# EAGLE design sleep_light (EAGLE 7.5.0)
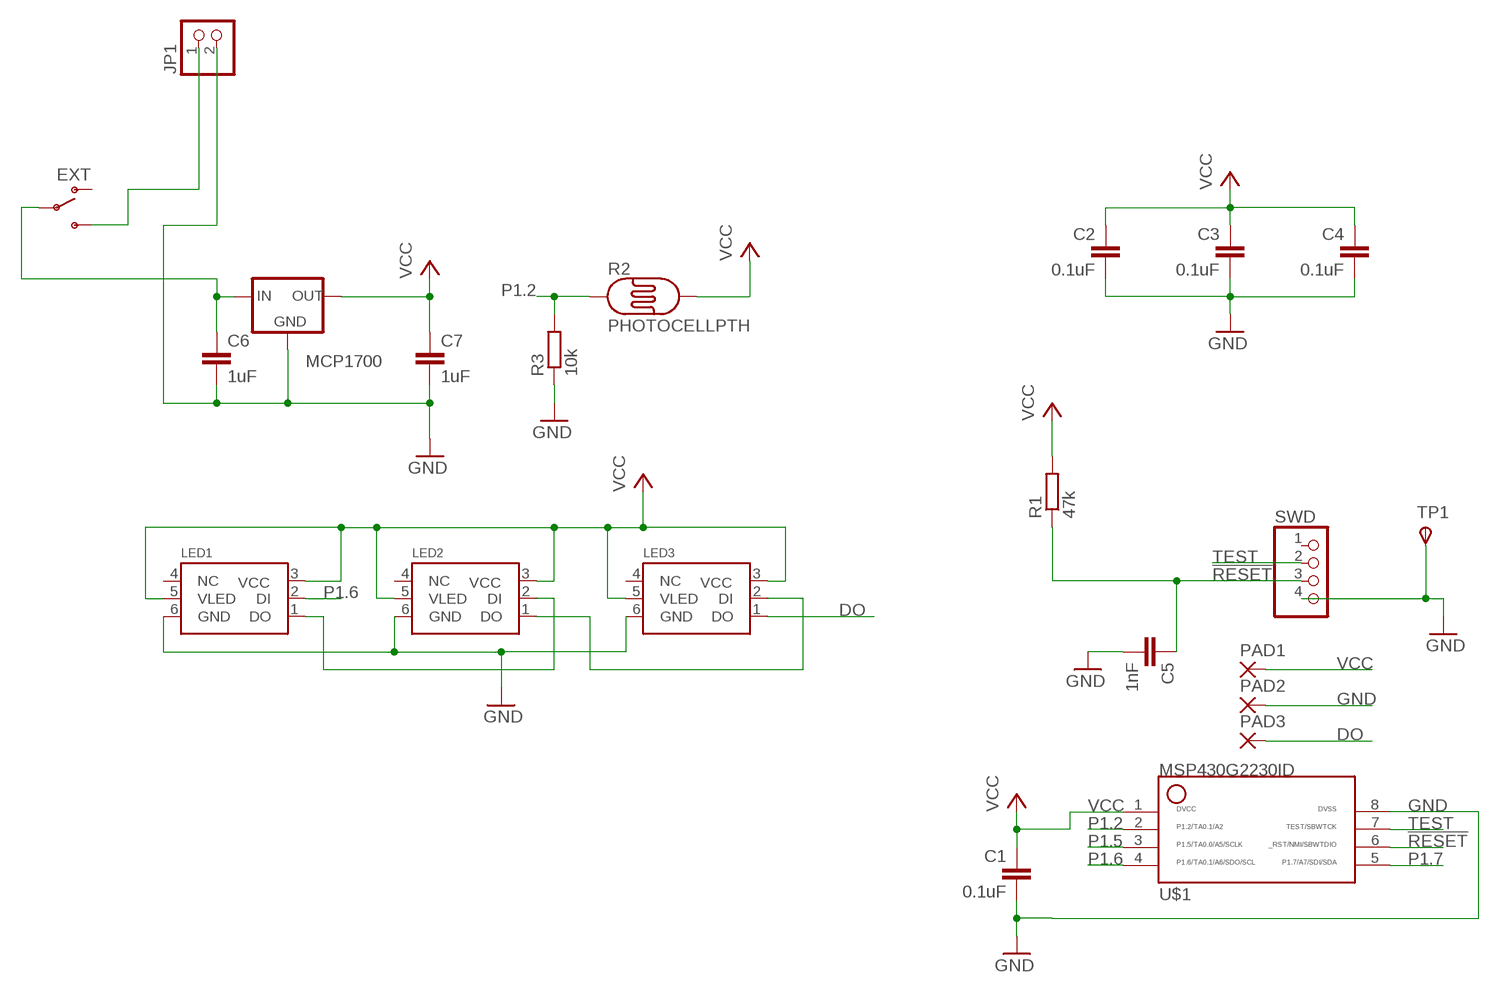
[diagram p0: schematic, sheet 1]

## Parts
C1  0.1uF  C-EUC0805  [C0805]
C2  0.1uF  C-EUC0805  [C0805]
C3  0.1uF  C-EUC0805  [C0805]
C4  0.1uF  C-EUC0805  [C0805]
C5  1nF  C-EUC0805  [C0805]
C6  1uF  C-EUC0805  [C0805]
C7  1uF  C-EUC0805  [C0805]
JP1  PINHD-1X2  [1X02]
LED1  5050WS2811W  [RGBLED5050W]
LED2  5050WS2811W  [RGBLED5050W]
LED3  5050WS2811W  [RGBLED5050W]
MCP1700  MCP1700  MCP1700SOT-23  [SOT-23]
ON  EXT  SWITCH-SPSTPTH  [SWITCH-SPDT]
PAD1  SMD2  [SMD1,27-2,54]
PAD2  SMD2  [SMD1,27-2,54]
PAD3  SMD2  [SMD1,27-2,54]
R1  47k  R-EU_R0805  [R0805]
R2  PHOTOCELLPTH  [PHOTOCELL]
R3  10k  R-EU_R0805  [R0805]
SWD  PINHD-1X4  [1X04]
TP1  TPSTP20R  [TP20R]
U$1  MSP430G2230ID  [SO08]

## Nets
!RESET: C5.1 R1.1 SWD.3 U$1.6
DO: LED3.1(DO) PAD3.1(P)
GND [GND]: C1.2 C2.2 C3.2 C4.2 C5.2 C6.2 C7.2 JP1.2 LED1.6(GND) LED2.6(GND) LED3.6(GND) MCP1700.1(GND) PAD2.1(P) R3.1 SWD.4 TP1.TP(PP) U$1.8
N$3 [VCC]: JP1.1 ON.3(S)
N$6: LED2.1(DO) LED3.2(DI)
N$7: LED1.1(DO) LED2.2(DI)
N$15 [VCC]: C6.1 MCP1700.3(IN) ON.2(P)
P1.2: R2.1 R3.2 U$1.2
P1.5: U$1.3
P1.6: LED1.2(DI) U$1.4
P1.7: U$1.5
TEST: SWD.2 U$1.7
VCC [VCC]: C1.1 C2.1 C3.1 C4.1 C7.1 LED1.3(VCC) LED1.5(VLED) LED2.3(VCC) LED2.5(VLED) LED3.3(VCC) LED3.5(VLED) MCP1700.2(OUT) PAD1.1(P) R1.2 R2.2 U$1.1
Unconnected: LED1.4(NC) LED2.4(NC) LED3.4(NC) ON.1(O) SWD.1

## Library data of the parts
C1-C7 = resistor:C-EU: CAPACITOR, European symbol
JP1 = pinhead:PINHD-1X2: PIN HEADER
LED1-LED3 = 5050WS2811:5050WS2811
MCP1700 = MY_IC:MCP1700
ON = SparkFun:SWITCH-SPST: SPST Switch Simple slide switch. Spark Fun Electronics SKU : COM-00102
PAD1-PAD3 = wirepad:SMD2: SMD PAD
R1 R3 = resistor:R-EU_: RESISTOR, European symbol
R2 = SparkFun:PHOTOCELL: Photocell Also known as a CdS photoresistor. This is a low cost way to detect light levels. Resistance decreases with more incoming light. SparkFun SKU: SEN-09088
SWD = pinhead:PINHD-1X4: PIN HEADER
TP1 = testpad:TPS: TEST PIN
U$1 = thierry_eagle:MSP430G2230ID

## Net classes
0 default: width 0.406 mm, drill 0.508 mm
1 GND: width 0.61 mm, drill 0.508 mm
2 VCC: width 1.016 mm, drill 0.508 mm

## Board
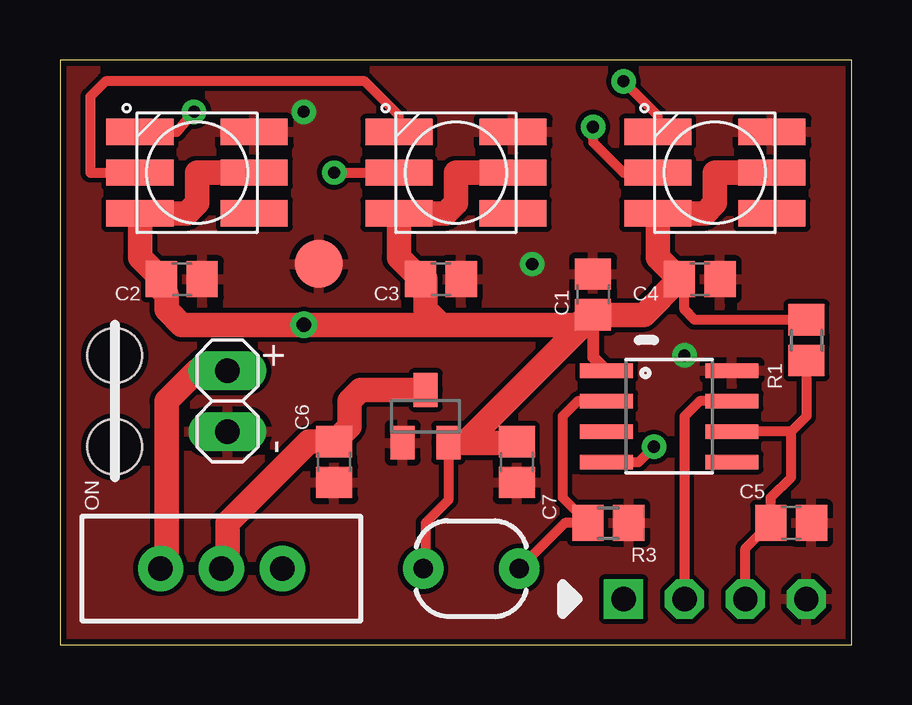
[diagram p1: board, top side]
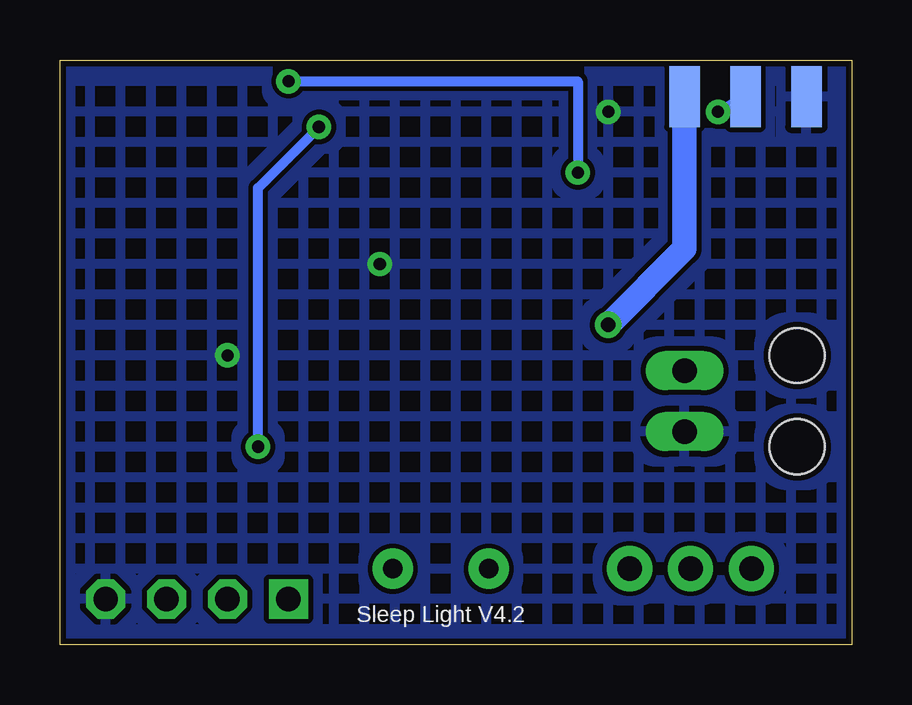
[diagram p2: board, bottom side, seen from below]

Size 33.02 x 24.38 mm. Coordinates in mm from the lower left corner, seen from the top.
Outline: 0,0 33.02,0 33.02,24.38 0,24.38 0,0
Copper layers (1*16): Top 0.035mm / dielectric 1.5mm / Bottom 0.035mm
Design rules "SparkFun *": minimum track width 10mil, minimum drill 20mil, track to track 8mil, track to pad 8mil, pad to pad 8mil, via to via 8mil, smd to smd 8mil, copper to edge 10mil, drill to drill 8mil, minimum pad ring 12mil, minimum via ring 10mil, stop-mask expansion 4mil, vias tented up to drill 25mil, thermal gap 10mil
Holes 2.29 mm at 2.29,12.07 2.29,8.25

### Footprints (pad centres in the part's own frame; a part is rotated, then mirrored left to right if it is on the bottom)
C0805 = smd 1.3 x 1.5: 1 -0.85,0; 2 0.85,0
1X02 = drill 1.016 long: 1 -1.27,0; 2 1.27,0
RGBLED5050W = smd 2.794 x 1.1: 1 -2.381,1.7; 2 -2.381,0; 3 -2.381,-1.7; 4 2.381,-1.7; 5 2.381,0; 6 2.381,1.7
SOT-23 = smd 1 x 1.4: 1 -0.95,-1.1; 2 0.95,-1.1; 3 0,1.1
SWITCH-SPDT = drill 1.016 pad 1.88: 1 0,2.54; 2 0,0; 3 0,-2.54
SMD1,27-2,54 = smd 1.27 x 2.54: 1 0,0
R0805 = smd 1.3 x 1.5: 1 -0.85,0; 2 0.85,0
PHOTOCELL = drill 0.8 pad 1.676: 1 -2,0; 2 2,0
1X04 = drill 1.016 square: 1 -3.81,0 | drill 1.016 octagon: 2 -1.27,0; 3 1.27,0; 4 3.81,0
TP20R = smd 2 x 2: TP 0,0
SO08 = smd 0.61 x 2.21: 1 -1.905,-2.616; 2 -0.635,-2.616; 3 0.635,-2.616; 4 1.905,-2.616; 5 1.905,2.616; 6 0.635,2.616; 7 -0.635,2.616; 8 -1.905,2.616

### Placement (x,y rotation side)
C1  22.22,14.61 90 top
C2  5.08,15.24 0 top
C3  15.88,15.24 0 top
C4  26.67,15.24 0 top
C5  30.48,5.08 0 top
C6  11.43,7.62 270 top
C7  19.05,7.62 270 top
JP1  6.98,10.16 270 top
LED1  27.31,19.69 0 top
LED2  16.51,19.69 0 top
LED3  5.71,19.69 0 top
MCP1700  15.24,9.53 0 top
ON  6.73,3.17 270 top
PAD1  6.98,22.86 0 bottom
PAD2  1.91,22.86 0 bottom
PAD3  4.45,22.86 0 bottom
R1  31.11,12.7 90 top
R2  17.14,3.17 180 top
R3  22.86,5.08 180 top
SWD  27.31,1.91 0 top
TP1  10.8,15.88 0 top
U$1  25.4,9.53 270 top

### Tracks (layer width: path | path; a pad name or v marks a point on that pad's centre or on a via)
!RESET
  Top 0.406: SWD.3 28.57,4.02 C5.1 29.63,6.13 30.48,6.99 30.48,8.89 | R1.1 31.11,9.53 30.48,8.89 | 30.48,8.89 U$1.6
DO  (via drill 0.51)
  Top 0.406: LED3.1 4.88,21.39 v5.59,22.23
  Bottom 0.406: v5.59,22.23 PAD3.1
GND  (via drill 0.51)
  other vias: 10.16,22.23 19.68,15.88 26.04,12.07
  pour Bottom (hatched): -0.63,24.77 33.66,24.77 33.66,-0.64 -0.63,-0.64
  pour Top: -0.63,24.77 33.66,24.77 33.66,-0.64 -0.63,-0.64
N$3
  Top 1.016: JP1.1 5.71,11.43 4.45,10.16 4.45,3.43 ON.3
N$6
  Top 0.406: LED2.1 14.13,22.07 12.7,23.5 1.91,23.5 1.27,22.86 1.27,19.69 LED3.2
N$7  (via drill 0.51)
  Top 0.406: LED1.1 24.92,22.07 v23.5,23.5 | v11.43,19.69 LED2.2
  Bottom 0.406: v23.5,23.5 11.43,23.5 v11.43,19.69
N$15
  Top 1.016: ON.2 6.98,3.43 6.98,5.08 10.38,8.47 C6.1 12.07,9.11 12.07,10.16 12.53,10.62 MCP1700.3
P1.2
  Top 0.406: U$1.2 21.59,10.16 20.96,9.53 20.96,6.13 R3.2 21.05,5.08 R2.1
P1.6  (via drill 0.51)
  Top 0.406: U$1.4 24.13,7.62 v24.77,8.25 | v22.22,21.59 22.22,20.96 23.5,19.69 LED1.2
  Bottom 0.406: v24.77,8.25 24.77,19.05 v22.22,21.59
TEST
  Top 0.406: U$1.7 26.67,10.16 26.04,9.53 SWD.2
VCC  (via drill 0.6)
  Top 0.406: R1.2 26.46,13.55 26.04,13.97 26.04,15.03 C4.1 | MCP1700.2 16.19,6.03 15.24,5.08 15.24,3.27 R2.2
  Top 0.508: C1.1 22.22,11.99 U$1.1
  Top 1.016: LED3.5 5.71,19.69 5.71,18.41 5.29,17.98 LED3.3 3.33,16.14 C2.1 4.23,14.82 4.45,14.61 4.45,13.97 5.08,13.34 v10.16,13.34 15.88,13.34 | LED2.5 16.51,19.69 16.51,18.41 16.08,17.98 LED2.3 14.13,16.14 C3.1 15.24,15.24 15.24,13.97 15.88,13.34 | LED1.5 27.31,19.69 27.31,18.41 26.88,17.98 LED1.3 24.92,16.14 C4.1 24.33,13.75 C1.1 | C7.1 19,8.43 MCP1700.2 16.89,8.43 C1.1 | 15.88,13.34 21.59,13.34 22.01,13.75 C1.1
  Bottom 1.016: PAD1.1 6.98,16.51 v10.16,13.34

### Text on the board
tNames: + | -
bNames: Sleep Light V4.2